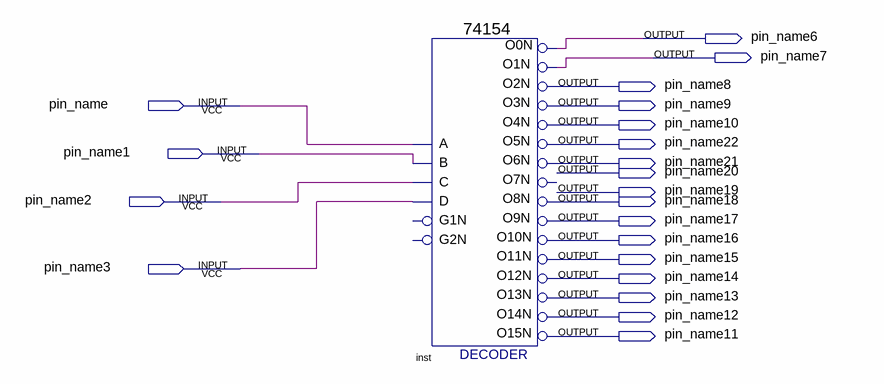
[diagram p0: schematic sheet]
// Quartus schematic libDecoder.bdf as structural Verilog: 1 symbols, 21 pins
module libDecoder (
  input  pin_name,
  input  pin_name1,
  input  pin_name2,
  input  pin_name3,
  output pin_name6,
  output pin_name7,
  output pin_name8,
  output pin_name9,
  output pin_name10,
  output pin_name22,
  output pin_name21,
  output pin_name20,
  output pin_name19,
  output pin_name18,
  output pin_name17,
  output pin_name16,
  output pin_name15,
  output pin_name14,
  output pin_name13,
  output pin_name12,
  output pin_name11
);

  \74154  inst (
    .C(pin_name2), .D(pin_name3), .B(pin_name1), .A(pin_name), .O0N(pin_name6), .O12N(pin_name14),
    .O15N(pin_name11), .O10N(pin_name16), .O11N(pin_name15), .O1N(pin_name7), .O13N(pin_name13),
    .O14N(pin_name12), .O4N(pin_name10), .O3N(pin_name9), .O2N(pin_name8), .O6N(pin_name21),
    .O5N(pin_name22), .O9N(pin_name17), .O8N(pin_name18));  // open: G1N, G2N, O7N
endmodule
